# Altium schematic sheet Sheet2.SchDoc: Sense Stage
size Tabloid; DocumentNumber: LM-002; Revision: F; SheetNumber: 2; SheetTotal: 2; DocumentName: LM-002
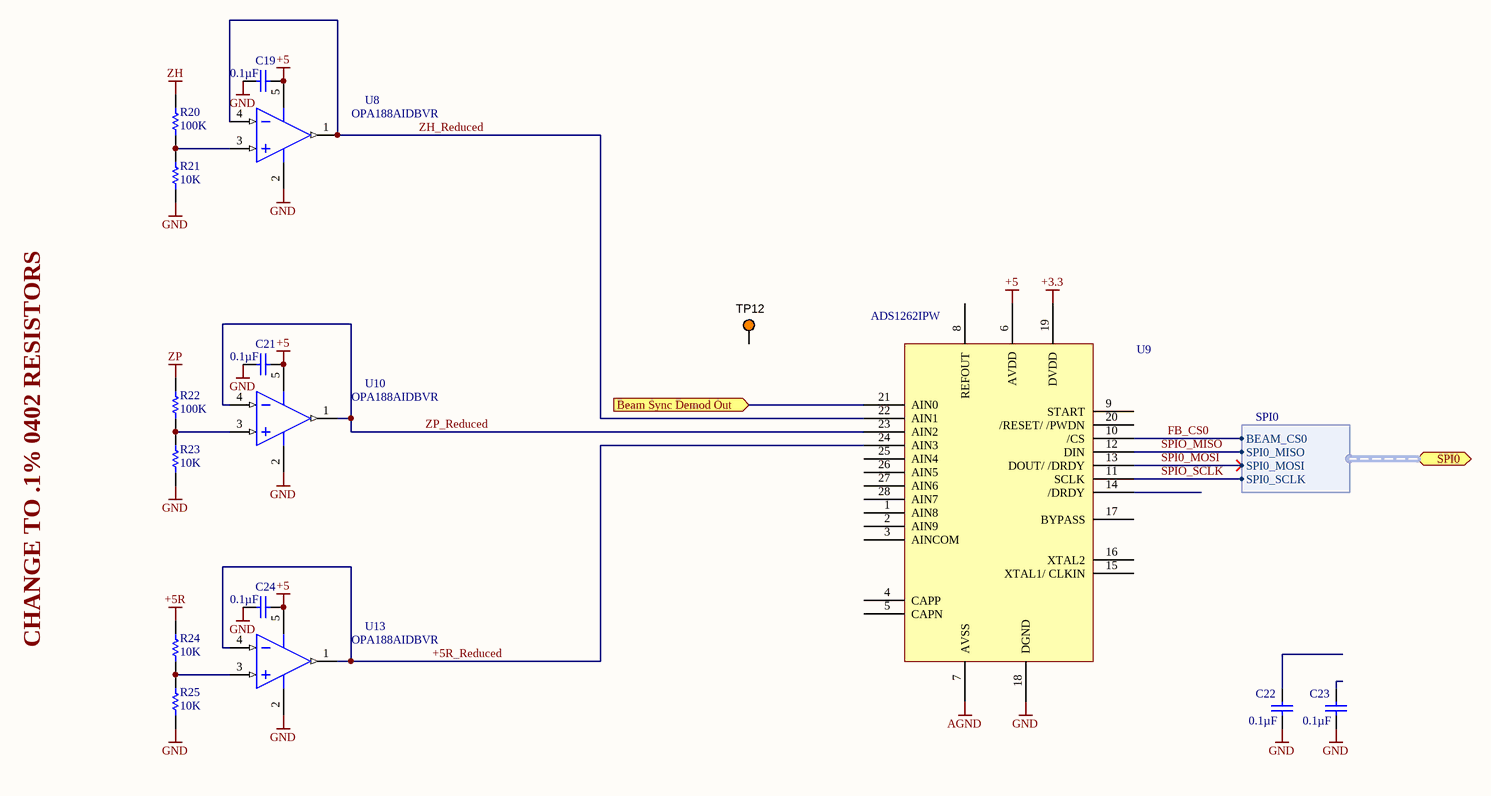
[diagram p0: Sheet2.SchDoc]

## Parts
C19  Capacitance: 0.1µF  [CAPC0805(2012)145_N]  (hidden comment: CAP CER 0.1UF 25V X7R 0805)
C21  Capacitance: 0.1µF  [CAPC0805(2012)145_N]  (hidden comment: CAP CER 0.1UF 25V X7R 0805)
C22  Capacitance: 0.1µF  [CAPC0805(2012)145_N]  (hidden comment: CAP CER 0.1UF 25V X7R 0805)
C23  Capacitance: 0.1µF  [CAPC0805(2012)145_N]  (hidden comment: CAP CER 0.1UF 25V X7R 0805)
C24  Capacitance: 0.1µF  [CAPC0805(2012)145_N]  (hidden comment: CAP CER 0.1UF 25V X7R 0805)
R20  100K  [RESC0805(2012)_L]
R21  10K  [RESC0805(2012)_L]
R22  100K  [RESC0805(2012)_L]
R23  10K  [RESC0805(2012)_L]
R24  10K  [RESC0805(2012)_L]
R25  10K  [RESC0805(2012)_L]
TP12  5003  [KSTN-5003]  (value not drawn)
U8  OPA188AIDBVR  [DBV0005A_M]
U9  Supplier Part Number 1: ADS1262IPW  [ADS1262]  (hidden comment: ADS1262)
U10  OPA188AIDBVR  [DBV0005A_M]
U13  OPA188AIDBVR  [DBV0005A_M]

## Ports
Beam Sync Demod Out (in), SPI0 (harness SPI0)

## Harnesses
SPI0: BEAM_CS0, SPI0_MOSI, SPI0_MISO, SPI0_SCLK

## Nets
+3.3: U9.19(DVDD)
+5: C19.2 C21.2 C24.2 U8.5(V+) U9.6(AVDD) U10.5(V+) U13.5(V+)
+5R: R24.2
AGND: U9.7(AVSS)
GND: C19.1 C21.1 C22.2 C23.2 C24.1 R21.1 R23.1 R25.1 U8.2(V-) U9.18(DGND) U10.2(V-) U13.2(V-)
ZH: R20.2
ZP: R22.2
+5R_Reduced: U9.24(AIN3) U13.1(OUT) U13.4(IN-)
Beam Sync Demod Out: U9.21(AIN0) ; port Beam Sync Demod Out
FB_CS0: U9.10(/CS) ; port SPI0.BEAM_CS0
SPI0_MOSI: U9.13(DOUT/_/DRDY) ; port SPI0.SPI0_MOSI
SPIO_MISO: U9.12(DIN) ; port SPI0.SPI0_MISO
SPIO_SCLK: U9.11(SCLK) ; port SPI0.SPI0_SCLK
ZH_Reduced: U8.1(OUT) U8.4(IN-) U9.22(AIN1)
ZP_Reduced: U9.23(AIN2) U10.1(OUT) U10.4(IN-)
NetR20_1: R20.1 R21.2 U8.3(IN+)
NetR22_1: R22.1 R23.2 U10.3(IN+)
NetR24_1: R24.1 R25.2 U13.3(IN+)

Not connected (* = marked no-connect by the designer): C22 1; C23 1; TP12 1; U9 1(AIN8) 2(AIN9) 3(AINCOM) 4(CAPP) 5(CAPN) 8(REFOUT) 9(START) 14(/DRDY) 15(XTAL1/_CLKIN) 16(XTAL2) 17(BYPASS) 20(/RESET/_/PWDN) 25(AIN4) 26(AIN5) 27(AIN6) 28(AIN7)

## Notes on the sheet
- CHANGE TO .1% 0402 RESISTORS
- Title
- Size:
- Date:
- Tabloid
- Number:
- Time:
- Revision:
- Sheet
- of
- ZLS Corporation
- 7801 North Lamar Blvd.
- Suite E-184
- Austin, Texas 78752  USA
- (512) 453-0288
- File:

## Library data of the parts
C19 C21-C24 = CMP-1036-04795-1: Manufacturer: Murata Electronics North America; Manufacturer Part Number: GRM21BR71E104KA01L; Tolerance: ±10%; Supplier 1: Digi-Key; Supplier Part Number 1: 490-1673-6-ND; RoHS: RoHS Compliant; Category: Capacitors; Stock 1: 891652; Pricing 1: 1=0.2, 10=0.145, 100=0.0683, 500=0.04788, 1000=0.03964 (USD); Packaging: Digi-Reel®; Part Status: Active; Voltage - Rated: 25V; Temperature Coefficient: X7R; Operating Temperature: -55°C ~ 125°C; Features: -; Ratings: -; Applications: General Purpose; Mounting Type: Surface Mount, MLCC; Package / Case: 0805 (2012 Metric); Size / Dimension: 0.079" L x 0.049" W (2.00mm x 1.25mm); Height - Seated (Max): -; Thickness (Max): 0.053" (1.35mm); Lead Spacing: -; Lead Style: -; ComponentLink1URL: http://www.murata.com/~/media/webrenewal/support/library/catalog/products/capacitor/mlcc/c02e.ashx; ComponentLink1Description: http://www.murata.com/~/media/webrenewal/support/library/catalog/products/capacitor/mlcc/c02e.ashx
R20 R22 = CMP-1013-00215-1: RES SMD 100K OHM 1% 1/8W 0805; Manufacturer: Vishay Dale; Manufacturer Part Number: RCA0805100KFKEA; Power (Watts): 0.125W, 1/8W; Temperature Coefficient: ±100ppm/°C; Supplier 1: Digi-Key; Supplier Part Number 1: 541-2230-1-ND; RoHS: RoHS Compliant; Category: Resistors; Stock 1: 18704; Pricing 1: 1=0.1, 10=0.079, 100=0.0303, 1000=0.01331, 2500=0.0115 (USD); Packaging: Cut Tape (CT); Part Status: Active; Tolerance: ±1%; Composition: Thick Film; Features: Anti-Sulfur, Automotive AEC-Q200; Operating Temperature: -55°C ~ 155°C; Package / Case: 0805 (2012 Metric); Supplier Device Package: 0805; Size / Dimension: 0.079" L x 0.049" W (2.01mm x 1.25mm); Height - Seated (Max): 0.020" (0.50mm); Failure Rate: -; ComponentLink1URL: http://www.vishay.com/docs/20037/rcae3.pdf; ComponentLink1Description: http://www.vishay.com/docs/20037/rcae3.pdf
R21 R23-R25 = CMP-1013-00215-1: RES SMD 10K OHM 1% 1/8W 0805; Manufacturer: Vishay Dale; Manufacturer Part Number: CRCW080510K0FKEA; Power (Watts): 0.125W, 1/8W; Temperature Coefficient: ±100ppm/°C; Supplier 1: Digi-Key; Supplier Part Number 1: 541-10.0KCCT-ND; RoHS: RoHS Compliant; Category: Resistors; Stock 1: 1104982; Pricing 1: 1=0.1, 10=0.055, 100=0.0223, 1000=0.01003, 2500=0.0087 (USD); Packaging: Cut Tape (CT); Part Status: Active; Tolerance: ±1%; Composition: Thick Film; Features: Automotive AEC-Q200; Operating Temperature: -55°C ~ 155°C; Package / Case: 0805 (2012 Metric); Supplier Device Package: 0805; Size / Dimension: 0.079" L x 0.049" W (2.00mm x 1.25mm); Height - Seated (Max): 0.020" (0.50mm); Failure Rate: -; ComponentLink1URL: http://www.vishay.com/docs/20035/dcrcwe3.pdf; ComponentLink1Description: http://www.vishay.com/docs/20035/dcrcwe3.pdf
TP12 = CMP-1672-00009-1: Test Point, Orange, 1-Pin THD, RoHS; Peak Reverse Current: 600 uA; Forward Current: 3 A; Max Surge Current: 80 A; Forward Voltage: 1.08 V; Max Operating Temperature: 150 degC; PackageReference: 5003; Pins: 2; ComponentLink2URL: http://keyelco.com/userAssets/file/M65p56.pdf; PackageDescription: 1-Pin Through Hole Device, Dia 2.54 mm; Weight: 0.01 lb; Diameter: 5.3 mm; Mount: Through Hole; Package Quantity: 500; Packaging: Bulk; Min Operating Temperature: -65 degC; ComponentLink1Description: Manufacturer URL; Height: 0.25 inch; ComponentLink1URL: http://www.keyelco.com/; ComponentLink2Description: Datasheet; Width: 0.25 inch; REACH SVHC: No SVHC; RoHSCompliant: true; Radiation Hardening: No; Length: 9.5 mm; DatasheetVersion: Jun-15
U8 U10 U13 = CMP-0809-00005-2: Precision, Low Noise, Rail-to-Rail Output, Zero-Drift Operational Amplifier, 4 to 36 V, -40 to 125 degC, 5-pin SOT23 (DBV5), Green (RoHS & no Sb/Br); Manufacturer: Texas Instruments; Total Supply Voltage(Min)(+5V is 5, +/-5V is 10): 4; Offset Drift(Typ)(uV/C): 0.03; Rating: Catalog; SubFamily: Zero Drift Precision Amplifier; GBW(Typ)(MHz): 2; Slew Rate(Typ)(V/us): 0.8; Number of Channels: 1; CMRR(Min)(dB): 120; Iq per channel(Max)(mA): 0.51; Total Supply Voltage(Max)(+5V is 5, +/-5V is 10): 36; PartNumber: OPA188AIDBVR; ComponentLink2Description: Datasheet; ComponentLink2URL: http://www.ti.com/lit/ds/symlink/opa188.pdf; ComponentLink1Description: Manufacturer URL; Mounting Technology: Surface Mount; Eco-Plan: Green (RoHS & no Sb/Br); ComponentLink1URL: http://www.ti.com/; PackageVersion: 4073253-4/K, 03/2006; DatasheetVersion: SBOS642A; ComponentLink3Description: Package Specification; PackageReference: DBV0005A; ComponentLink3URL: http://www.ti.com/litv/pdf/mpds018i; PackageDescription: 5-Pin Plastic Small Outline, Body 1.6 x 2.9 mm, Pitch 0.95 mm; Code_JEDEC: MO-178
U9 = ADS1262: 32 bit Analog to Digital Converter; Manufacturer: Texas Instruments; Description: IC ADC 32BIT 38KSPS 28TSSOP; Sampling Rate: 38400S/s; Interface: SPI; Number of A/D Converters: 1; Resolution: 32b; Number of Bits: 32; Min Supply Voltage: 4.75V; Max Supply Voltage: 5.25V; Power Consumption: 27mW; Supply Type: Single; Polarity: Bipolar,Unipolar; Operating Supply Voltage: 5V; Number of Inputs: 10; Supplier 1: Arrow; Manufacturer Part Number: ADS1262IPW; Stock 1: 86; Pricing 1: 1=18.662, 10=17.123, 100=14.538, 500=12.925 (USD); Mount: Surface Mount; Case/Package: TSSOP; Number of Pins: 28; Contact Plating: Gold; Min Operating Temperature: -40°C; Max Operating Temperature: 125°C; Packaging: Rail/Tube; REACH SVHC: No SVHC; Lead Free: Lead Free